# Altium project lipo_charger.PrjPcb
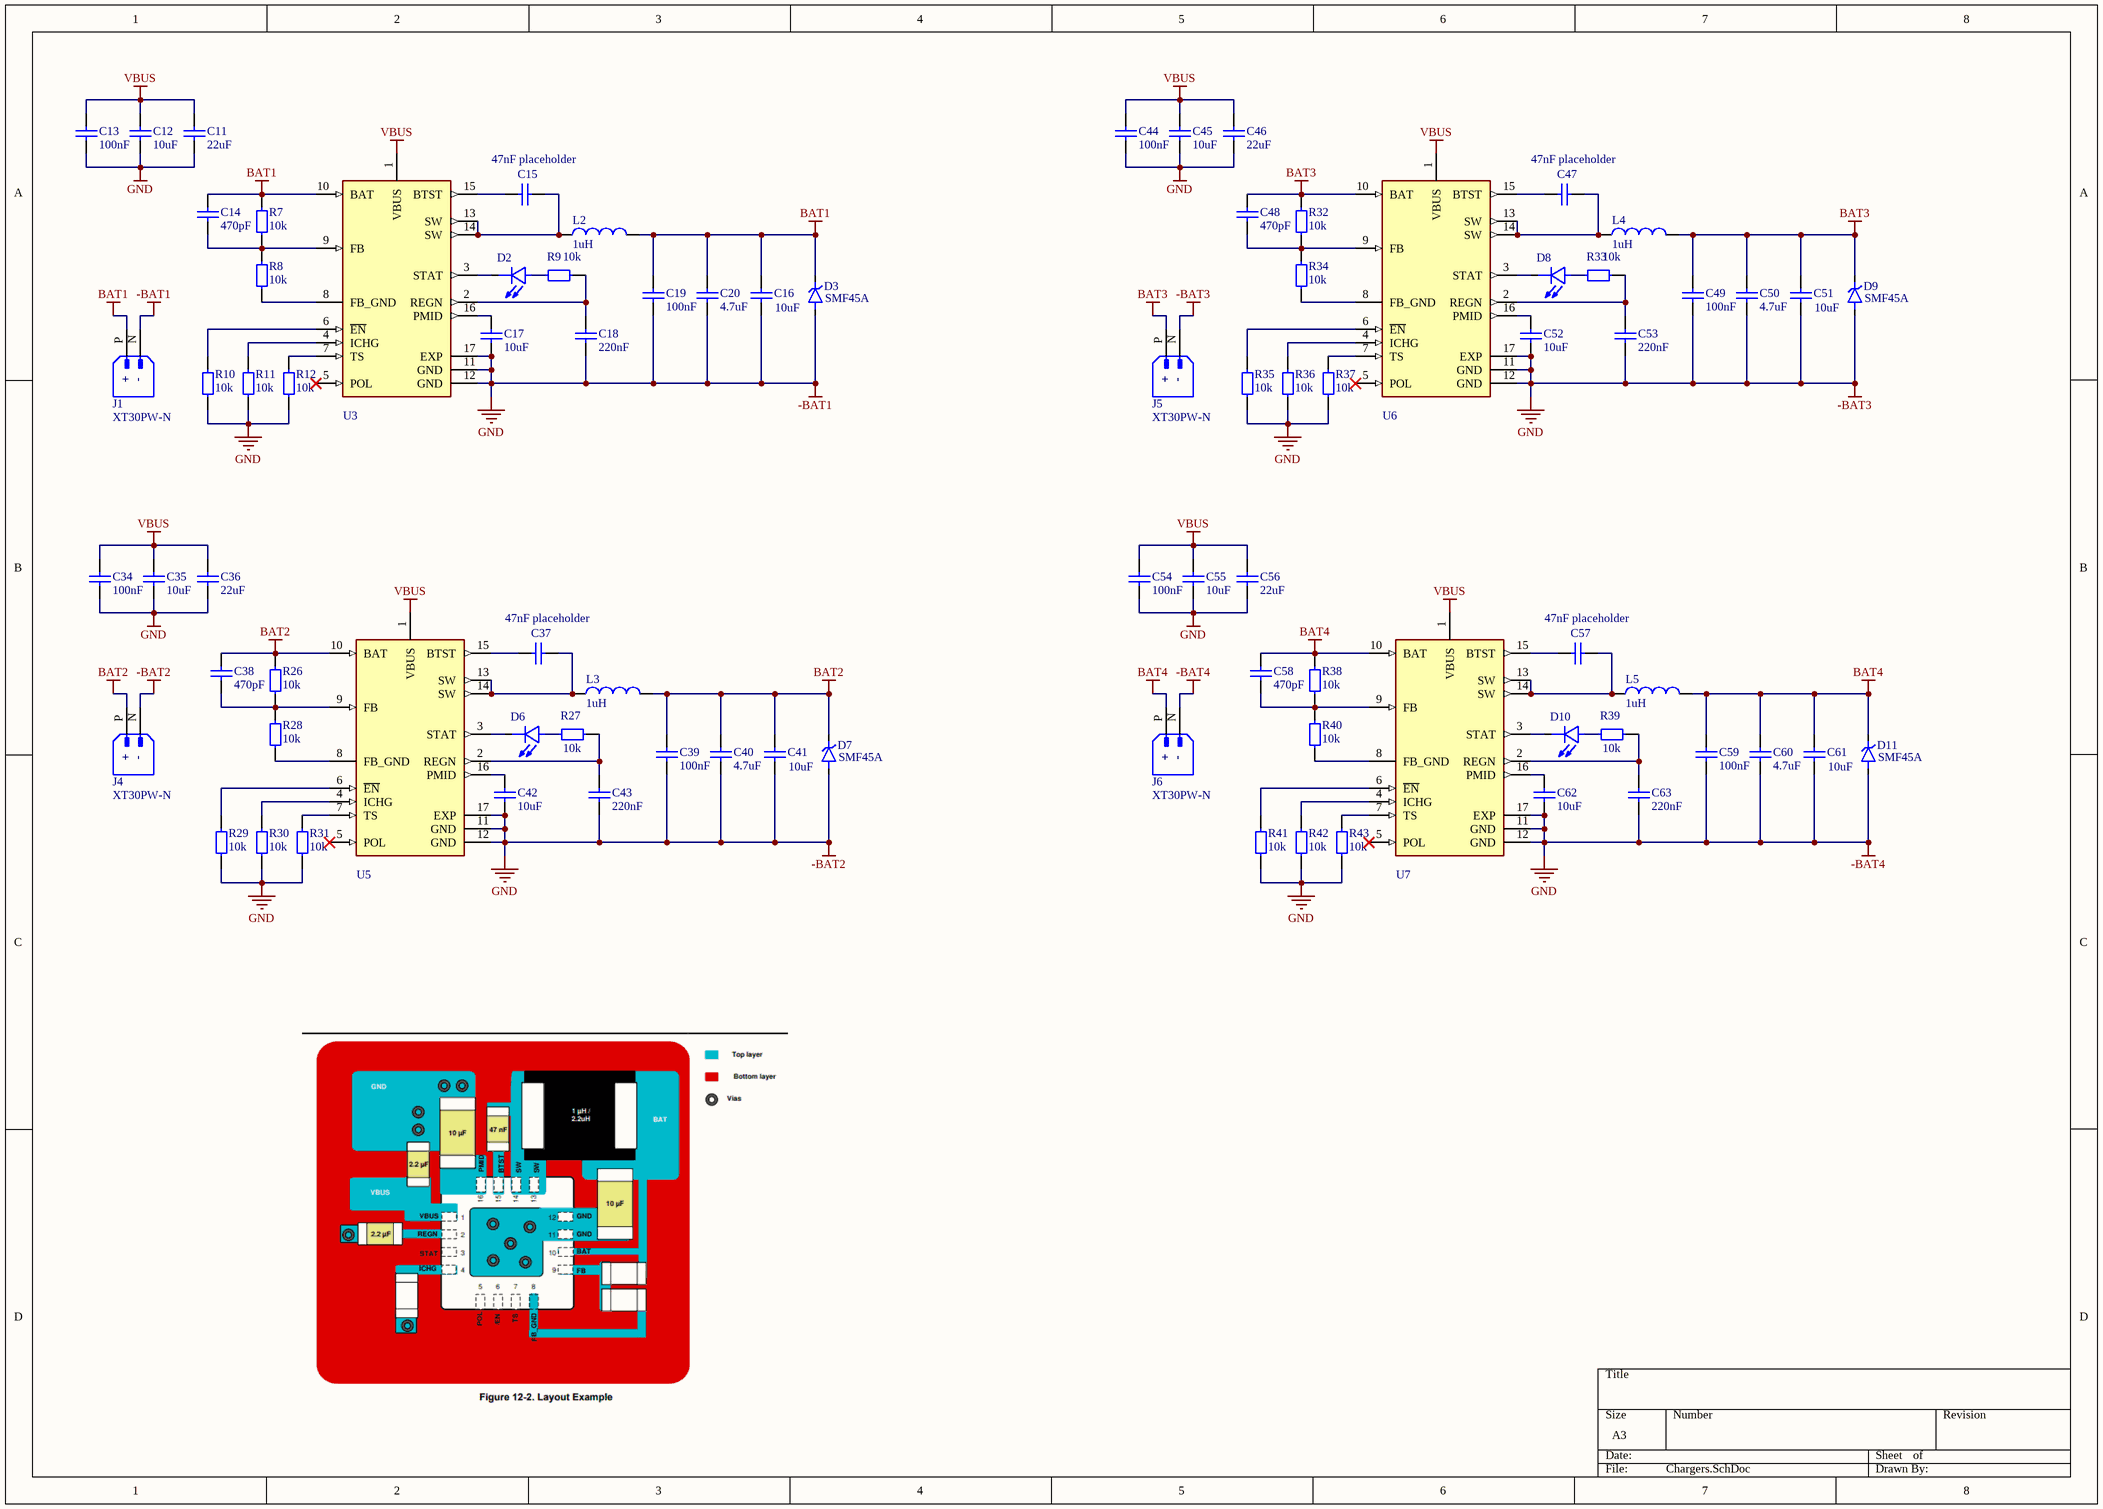
[diagram p0: Chargers.SchDoc]
6 sheets, 218 parts. Net scope: global (net labels, ports and power ports of the same name join across sheets).
Board file: PCB.PcbDoc
Sheets:
  Chargers.SchDoc
  Balancers.SchDoc
  MCU.SchDoc
  DCDC.SchDoc
  USB.SchDoc
  Dischargers.SchDoc

## Sheet Chargers.SchDoc
size A3; SheetNumber: 1; SheetTotal: 6

### Parts
C11  22uF  [1210_CAP]
C12  10uF  [0805_CAP]
C13  100nF  [0603 Capacitor]
C14  470pF  [0603 Capacitor]
C15  47nF placeholder  [0603 Capacitor]
C16  10uF  [0805_CAP]
C17  10uF  [0805_CAP]
C18  220nF  [0603 Capacitor]
C19  100nF  [0603 Capacitor]
C20  4.7uF  [0805_CAP]
C34  100nF  [0603 Capacitor]
C35  10uF  [0805_CAP]
C36  22uF  [1210_CAP]
C37  47nF placeholder  [0603 Capacitor]
C38  470pF  [0603 Capacitor]
C39  100nF  [0603 Capacitor]
C40  4.7uF  [0805_CAP]
C41  10uF  [0805_CAP]
C42  10uF  [0805_CAP]
C43  220nF  [0603 Capacitor]
C44  100nF  [0603 Capacitor]
C45  10uF  [0805_CAP]
C46  22uF  [1210_CAP]
C47  47nF placeholder  [0603 Capacitor]
C48  470pF  [0603 Capacitor]
C49  100nF  [0603 Capacitor]
C50  4.7uF  [0805_CAP]
C51  10uF  [0805_CAP]
C52  10uF  [0805_CAP]
C53  220nF  [0603 Capacitor]
C54  100nF  [0603 Capacitor]
C55  10uF  [0805_CAP]
C56  22uF  [1210_CAP]
C57  47nF placeholder  [0603 Capacitor]
C58  470pF  [0603 Capacitor]
C59  100nF  [0603 Capacitor]
C60  4.7uF  [0805_CAP]
C61  10uF  [0805_CAP]
C62  10uF  [0805_CAP]
C63  220nF  [0603 Capacitor]
D2  LTST-C190KGKT  [LED 0603]  (value not drawn)
D3  SMF45A  [SOD3718X102N]
D6  LTST-C190KGKT  [LED 0603]  (value not drawn)
D7  SMF45A  [SOD3718X102N]
D8  LTST-C190KGKT  [LED 0603]  (value not drawn)
D9  SMF45A  [SOD3718X102N]
D10  LTST-C190KGKT  [LED 0603]  (value not drawn)
D11  SMF45A  [SOD3718X102N]
J1  XT30PW-N  [AMASS_XT30UPB-M]
J4  XT30PW-N  [AMASS_XT30UPB-M]
J5  XT30PW-N  [AMASS_XT30UPB-M]
J6  XT30PW-N  [AMASS_XT30UPB-M]
L2  value 1uH  [HPPC05030]  (hidden comment: HPPC05030-1R0M-Q8)
L3  value 1uH  [HPPC05030]  (hidden comment: HPPC05030-1R0M-Q8)
L4  value 1uH  [HPPC05030]  (hidden comment: HPPC05030-1R0M-Q8)
L5  value 1uH  [HPPC05030]  (hidden comment: HPPC05030-1R0M-Q8)
R7  10k  [0603 Resistor]
R8  10k  [0603 Resistor]
R9  10k  [0603 Resistor]
R10  10k  [0603 Resistor]
R11  10k  [0603 Resistor]
R12  10k  [0603 Resistor]
R26  10k  [0603 Resistor]
R27  10k  [0603 Resistor]
R28  10k  [0603 Resistor]
R29  10k  [0603 Resistor]
R30  10k  [0603 Resistor]
R31  10k  [0603 Resistor]
R32  10k  [0603 Resistor]
R33  10k  [0603 Resistor]
R34  10k  [0603 Resistor]
R35  10k  [0603 Resistor]
R36  10k  [0603 Resistor]
R37  10k  [0603 Resistor]
R38  10k  [0603 Resistor]
R39  10k  [0603 Resistor]
R40  10k  [0603 Resistor]
R41  10k  [0603 Resistor]
R42  10k  [0603 Resistor]
R43  10k  [0603 Resistor]
U3  BQ25306RTER  [IC_BQ25306RTER]  (value not drawn)
U5  BQ25306RTER  [IC_BQ25306RTER]  (value not drawn)
U6  BQ25306RTER  [IC_BQ25306RTER]  (value not drawn)
U7  BQ25306RTER  [IC_BQ25306RTER]  (value not drawn)

### Nets
-BAT1: C11.2 C12.2 C13.2 C16.1 C17.1 C18.1 C19.1 C20.1 C34.2 C35.2 C36.2 C39.1 C40.1 C41.1 C42.1 C43.1 C44.2 C45.2 C46.2 C49.1 C50.1 C51.1 C52.1 C53.1 C54.2 C55.2 C56.2 C59.1 C60.1 C61.1 C62.1 C63.1 D3.A D7.A D9.A D11.A J1.N J4.N J5.N J6.N R10.1(CCW) R11.1(CCW) R12.1(CCW) R29.1(CCW) R30.1(CCW) R31.1(CCW) R35.1(CCW) R36.1(CCW) R37.1(CCW) R41.1(CCW) R42.1(CCW) R43.1(CCW) U3.11(GND) U3.12(GND) U3.17(EXP) U5.11(GND) U5.12(GND) U5.17(EXP) U6.11(GND) U6.12(GND) U6.17(EXP) U7.11(GND) U7.12(GND) U7.17(EXP)  [also labelled -BAT2, -BAT3, -BAT4, GND]
BAT1: C14.2 C16.2 C19.2 C20.2 D3.C(K1) J1.P(+) L2.2 R7.2(CW) U3.10(BAT)
BAT2: C38.2 C39.2 C40.2 C41.2 D7.C(K1) J4.P(+) L3.2 R26.2(CW) U5.10(BAT)
BAT3: C48.2 C49.2 C50.2 C51.2 D9.C(K1) J5.P(+) L4.2 R32.2(CW) U6.10(BAT)
BAT4: C58.2 C59.2 C60.2 C61.2 D11.C(K1) J6.P(+) L5.2 R38.2(CW) U7.10(BAT)
VBUS: C11.1 C12.1 C13.1 C34.1 C35.1 C36.1 C44.1 C45.1 C46.1 C54.1 C55.1 C56.1 U3.1(VBUS) U5.1(VBUS) U6.1(VBUS) U7.1(VBUS)
NetC14_1: C14.1 R7.1(CCW) R8.2(CW) U3.9(FB)
NetC15_1: C15.1 L2.1 U3.13(SW) U3.14(SW)
NetC15_2: C15.2 U3.15(BTST)
NetC17_2: C17.2 U3.16(PMID)
NetC18_2: C18.2 R9.1(CCW) U3.2(REGN)
NetC37_1: C37.1 L3.1 U5.13(SW) U5.14(SW)
NetC37_2: C37.2 U5.15(BTST)
NetC38_1: C38.1 R26.1(CCW) R28.2(CW) U5.9(FB)
NetC42_2: C42.2 U5.16(PMID)
NetC43_2: C43.2 R27.1(CCW) U5.2(REGN)
NetC47_1: C47.1 L4.1 U6.13(SW) U6.14(SW)
NetC47_2: C47.2 U6.15(BTST)
NetC48_1: C48.1 R32.1(CCW) R34.2(CW) U6.9(FB)
NetC52_2: C52.2 U6.16(PMID)
NetC53_2: C53.2 R33.1(CCW) U6.2(REGN)
NetC57_1: C57.1 L5.1 U7.13(SW) U7.14(SW)
NetC57_2: C57.2 U7.15(BTST)
NetC58_1: C58.1 R38.1(CCW) R40.2(CW) U7.9(FB)
NetC62_2: C62.2 U7.16(PMID)
NetC63_2: C63.2 R39.1(CCW) U7.2(REGN)
NetD2_1: D2.1(A) R9.2(CW)
NetD2_2: D2.2(C) U3.3(STAT)
NetD6_1: D6.1(A) R27.2(CW)
NetD6_2: D6.2(C) U5.3(STAT)
NetD8_1: D8.1(A) R33.2(CW)
NetD8_2: D8.2(C) U6.3(STAT)
NetD10_1: D10.1(A) R39.2(CW)
NetD10_2: D10.2(C) U7.3(STAT)
NetR8_1: R8.1(CCW) U3.8(FB_GND)
NetR10_2: R10.2(CW) U3.6(~{EN})
NetR11_2: R11.2(CW) U3.4(ICHG)
NetR12_2: R12.2(CW) U3.7(TS)
NetR28_1: R28.1(CCW) U5.8(FB_GND)
NetR29_2: R29.2(CW) U5.6(~{EN})
NetR30_2: R30.2(CW) U5.4(ICHG)
NetR31_2: R31.2(CW) U5.7(TS)
NetR34_1: R34.1(CCW) U6.8(FB_GND)
NetR35_2: R35.2(CW) U6.6(~{EN})
NetR36_2: R36.2(CW) U6.4(ICHG)
NetR37_2: R37.2(CW) U6.7(TS)
NetR40_1: R40.1(CCW) U7.8(FB_GND)
NetR41_2: R41.2(CW) U7.6(~{EN})
NetR42_2: R42.2(CW) U7.4(ICHG)
NetR43_2: R43.2(CW) U7.7(TS)

Not connected (* = marked no-connect by the designer): U3 5(POL)*; U5 5(POL)*; U6 5(POL)*; U7 5(POL)*

### Notes on the sheet
- (in symbol XT30PW-N) -

### Library data of the parts
C11 C36 C46 C56 = Capacitor 22uF 1210: 22uF 50V 1210
C12 C16 C17 C35 C41 C42 C45 C51 C52 C55 C61 C62 = Capacitor 10uF 0805: 10uF 50V 0805
C13 C19 C34 C39 C44 C49 C54 C59 = Capacitor 100nF 0603: 100nF 50V 0603
C14 C38 C48 C58 = Capacitor 470pF 0603: 470pF 50V 0603
C15 C37 C47 C57 = Capacitor 1nF 0603: 1nF 50V 0603
C18 C43 C53 C63 = Capacitor 220nF 0603: 220nF 50V 0603
C20 C40 C50 C60 = Capacitor 4.7uF 0805: 4.7uF 50V 0805
D2 D6 D8 D10 = LED 0603: 1.6x0.8mm Smd Chip Led Lamp; MF: Kingbright; MP: KPT-1608ZGC; Value: *; SnapEDA_Link: https://www.snapeda.com/parts/KPT-1608ZGC/Kingbright/view-part/?ref=snap; Availability: In Stock; Price: None; Package: 0603 Kingbright; Check_prices: https://www.snapeda.com/parts/KPT-1608ZGC/Kingbright/view-part/?ref=eda
D3 D7 D9 D11 = SMF45A: 1-channel  50V ultra-low-capacitance IEC ESD protection diode; MF: Texas Instruments; MP: TPD1E05U06DPYR; SnapEDA_Link: https://www.snapeda.com/parts/TPD1E05U06DPYR/Texas%20Instruments/view-part/383548/?ref=snap; Value: *; Texas_Instruments-Purchase-URL: https://snapeda.com/shop?store=Texas+Instruments&id=383548; Availability: Good; Price: None; Mouser-Purchase-URL: https://snapeda.com/shop?store=Mouser&id=383548; Package: X1SON-2 Texas Instruments; DigiKey-Purchase-URL: https://snapeda.com/shop?store=DigiKey&id=383548
J1 J4-J6 = XT30PW-N: Socket; DC supply; XT30; male; PIN: 2; on PCBs; THT; straight, Colour: yellow; MF: AMASS; MP: XT30PW-M; SnapEDA_Link: https://www.snapeda.com/parts/XT30PW-M/AMASS/view-part/?ref=snap; Package: None; Value: *; Check_prices: https://www.snapeda.com/parts/XT30PW-M/AMASS/view-part/?ref=eda
L2-L5 = 1uH 9A: 1uH 9A  8.9mΩ
R7-R12 R26-R43 = Resistor 10k 0603: 10k 0603
U3 U5-U7 = BQ25306RTER: TI Standalone 17-V, 3A 1-2 cell buck battery charger; MF: Texas Instruments; SnapEDA_Link: https://www.snapeda.com/parts/BQ25306RTER/Texas+Instruments/view-part/?ref=snap; Package: WFQFN-16 Texas Instruments; Value: *; MP: BQ25306RTER; Check_prices: https://www.snapeda.com/parts/BQ25306RTER/Texas+Instruments/view-part/?ref=eda

## Sheet Balancers.SchDoc
size A4; SheetNumber: 2; SheetTotal: 6
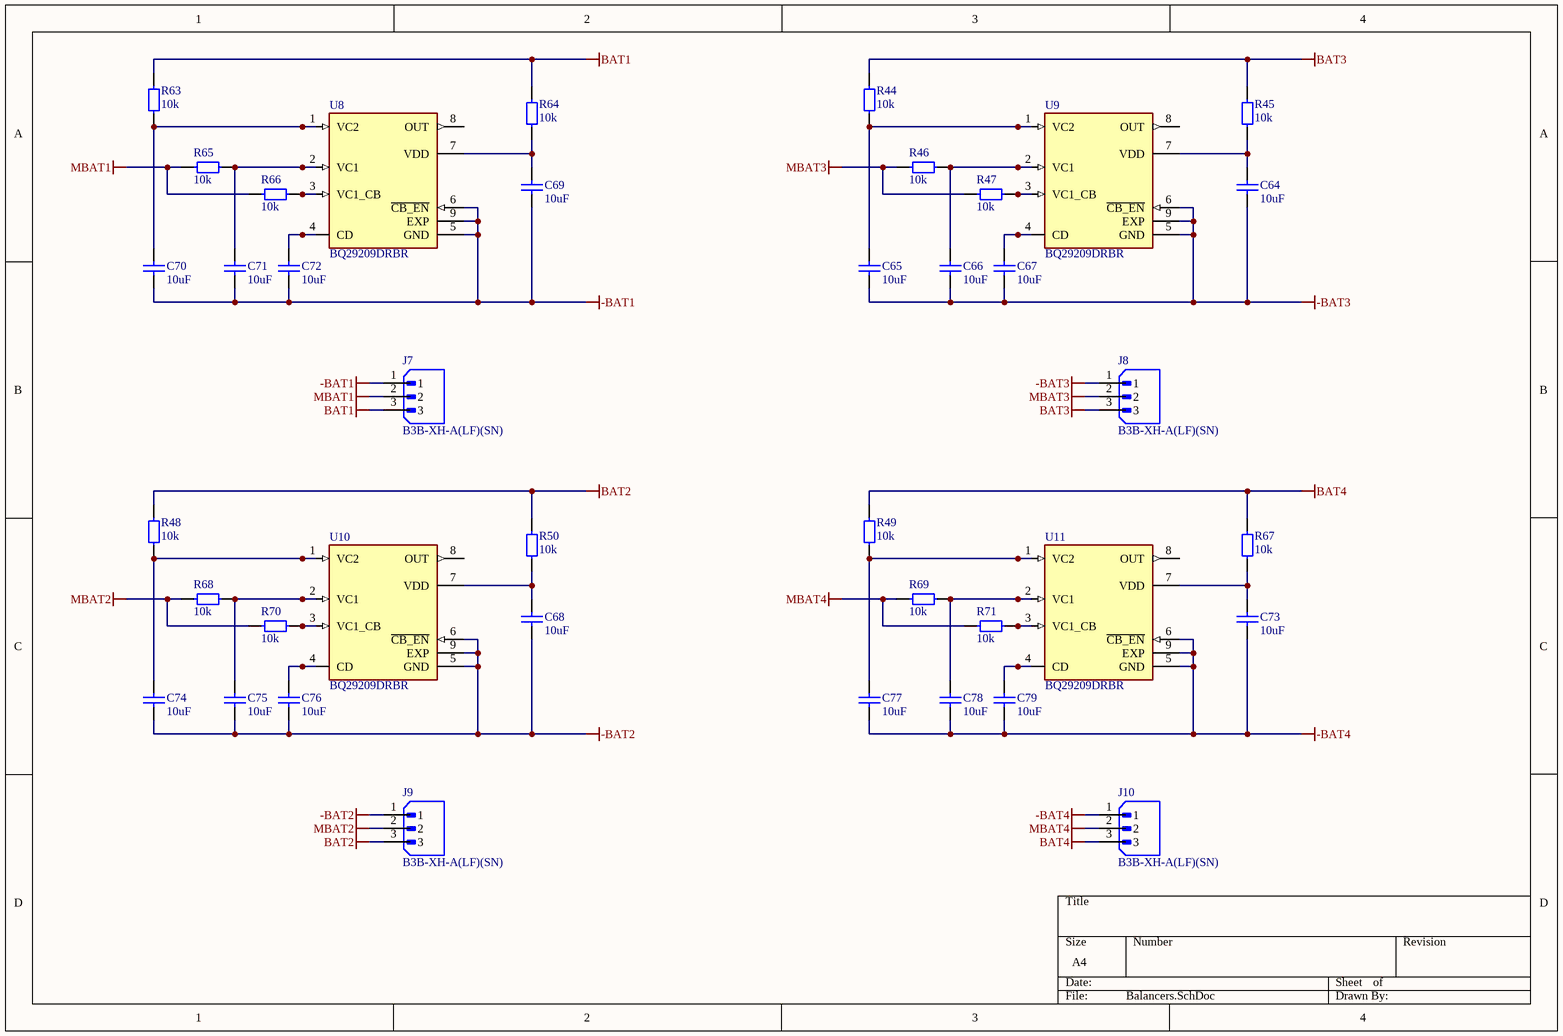
[diagram p1: Balancers.SchDoc]

### Parts
C64  10uF  [0805_CAP]
C65  10uF  [0805_CAP]
C66  10uF  [0805_CAP]
C67  10uF  [0805_CAP]
C68  10uF  [0805_CAP]
C69  10uF  [0805_CAP]
C70  10uF  [0805_CAP]
C71  10uF  [0805_CAP]
C72  10uF  [0805_CAP]
C73  10uF  [0805_CAP]
C74  10uF  [0805_CAP]
C75  10uF  [0805_CAP]
C76  10uF  [0805_CAP]
C77  10uF  [0805_CAP]
C78  10uF  [0805_CAP]
C79  10uF  [0805_CAP]
J7  B3B-XH-A(LF)(SN)  [JST_B3B-XH-A(LF)(SN)]
J8  B3B-XH-A(LF)(SN)  [JST_B3B-XH-A(LF)(SN)]
J9  B3B-XH-A(LF)(SN)  [JST_B3B-XH-A(LF)(SN)]
J10  B3B-XH-A(LF)(SN)  [JST_B3B-XH-A(LF)(SN)]
R44  10k  [0603 Resistor]
R45  10k  [0603 Resistor]
R46  10k  [0603 Resistor]
R47  10k  [0603 Resistor]
R48  10k  [0603 Resistor]
R49  10k  [0603 Resistor]
R50  10k  [0603 Resistor]
R63  10k  [0603 Resistor]
R64  10k  [0603 Resistor]
R65  10k  [0603 Resistor]
R66  10k  [0603 Resistor]
R67  10k  [0603 Resistor]
R68  10k  [0603 Resistor]
R69  10k  [0603 Resistor]
R70  10k  [0603 Resistor]
R71  10k  [0603 Resistor]
U8  BQ29209DRBR  [SON65P300X300X100-9N]
U9  BQ29209DRBR  [SON65P300X300X100-9N]
U10  BQ29209DRBR  [SON65P300X300X100-9N]
U11  BQ29209DRBR  [SON65P300X300X100-9N]

### Nets
-BAT1: C64.1 C65.1 C66.1 C67.1 C68.1 C69.1 C70.1 C71.1 C72.1 C73.1 C74.1 C75.1 C76.1 C77.1 C78.1 C79.1 J7.1 J8.1 J9.1 J10.1 U8.5(GND) U8.6(~{CB_EN}) U8.9(EXP) U9.5(GND) U9.6(~{CB_EN}) U9.9(EXP) U10.5(GND) U10.6(~{CB_EN}) U10.9(EXP) U11.5(GND) U11.6(~{CB_EN}) U11.9(EXP)  [also labelled -BAT2, -BAT3, -BAT4]
BAT1: J7.3 R63.2(CW) R64.2(CW)
BAT2: J9.3 R48.2(CW) R50.2(CW)
BAT3: J8.3 R44.2(CW) R45.2(CW)
BAT4: J10.3 R49.2(CW) R67.2(CW)
MBAT1: J7.2 R65.2(CW) R66.2(CW)
MBAT2: J9.2 R68.2(CW) R70.2(CW)
MBAT3: J8.2 R46.2(CW) R47.2(CW)
MBAT4: J10.2 R69.2(CW) R71.2(CW)
NetC64_2: C64.2 R45.1(CCW) U9.7(VDD)
NetC65_2: C65.2 R44.1(CCW) U9.1(VC2)
NetC66_2: C66.2 R46.1(CCW) U9.2(VC1)
NetC67_2: C67.2 U9.4(CD)
NetC68_2: C68.2 R50.1(CCW) U10.7(VDD)
NetC69_2: C69.2 R64.1(CCW) U8.7(VDD)
NetC70_2: C70.2 R63.1(CCW) U8.1(VC2)
NetC71_2: C71.2 R65.1(CCW) U8.2(VC1)
NetC72_2: C72.2 U8.4(CD)
NetC73_2: C73.2 R67.1(CCW) U11.7(VDD)
NetC74_2: C74.2 R48.1(CCW) U10.1(VC2)
NetC75_2: C75.2 R68.1(CCW) U10.2(VC1)
NetC76_2: C76.2 U10.4(CD)
NetC77_2: C77.2 R49.1(CCW) U11.1(VC2)
NetC78_2: C78.2 R69.1(CCW) U11.2(VC1)
NetC79_2: C79.2 U11.4(CD)
NetR47_1: R47.1(CCW) U9.3(VC1_CB)
NetR66_1: R66.1(CCW) U8.3(VC1_CB)
NetR70_1: R70.1(CCW) U10.3(VC1_CB)
NetR71_1: R71.1(CCW) U11.3(VC1_CB)

Not connected (* = marked no-connect by the designer): U8 8(OUT); U9 8(OUT); U10 8(OUT); U11 8(OUT)

### Library data of the parts
C64-C79 = Capacitor 10uF 0805: 10uF 50V 0805
J7-J10 = B3B-XH-A(LF)(SN): Connector Header Through Hole 3 position 0.098 (2.50mm); MF: JST Sales; SnapEDA_Link: https://www.snapeda.com/parts/B3B-XH-A(LF)(SN)/JST/view-part/?ref=snap; Package: None; Value: *; MP: B3B-XH-A(LF)(SN); Check_prices: https://www.snapeda.com/parts/B3B-XH-A(LF)(SN)/JST/view-part/?ref=eda
R44-R50 R63-R71 = Resistor 10k 0603: 10k 0603
U8-U11 = BQ29209DRBR: Voltage Protection with Automatic Cell Balance For 2-Cell Li-Ion Batteries, OVP=4.30V; MF: Texas Instruments; SnapEDA_Link: https://www.snapeda.com/parts/BQ29209DRBR/Texas+Instruments/view-part/?ref=snap; Package: VSON-8 Texas Instruments; Value: *; MP: BQ29209DRBR; Check_prices: https://www.snapeda.com/parts/BQ29209DRBR/Texas+Instruments/view-part/?ref=eda

## Sheet MCU.SchDoc
size A4; SheetNumber: 3; SheetTotal: 6
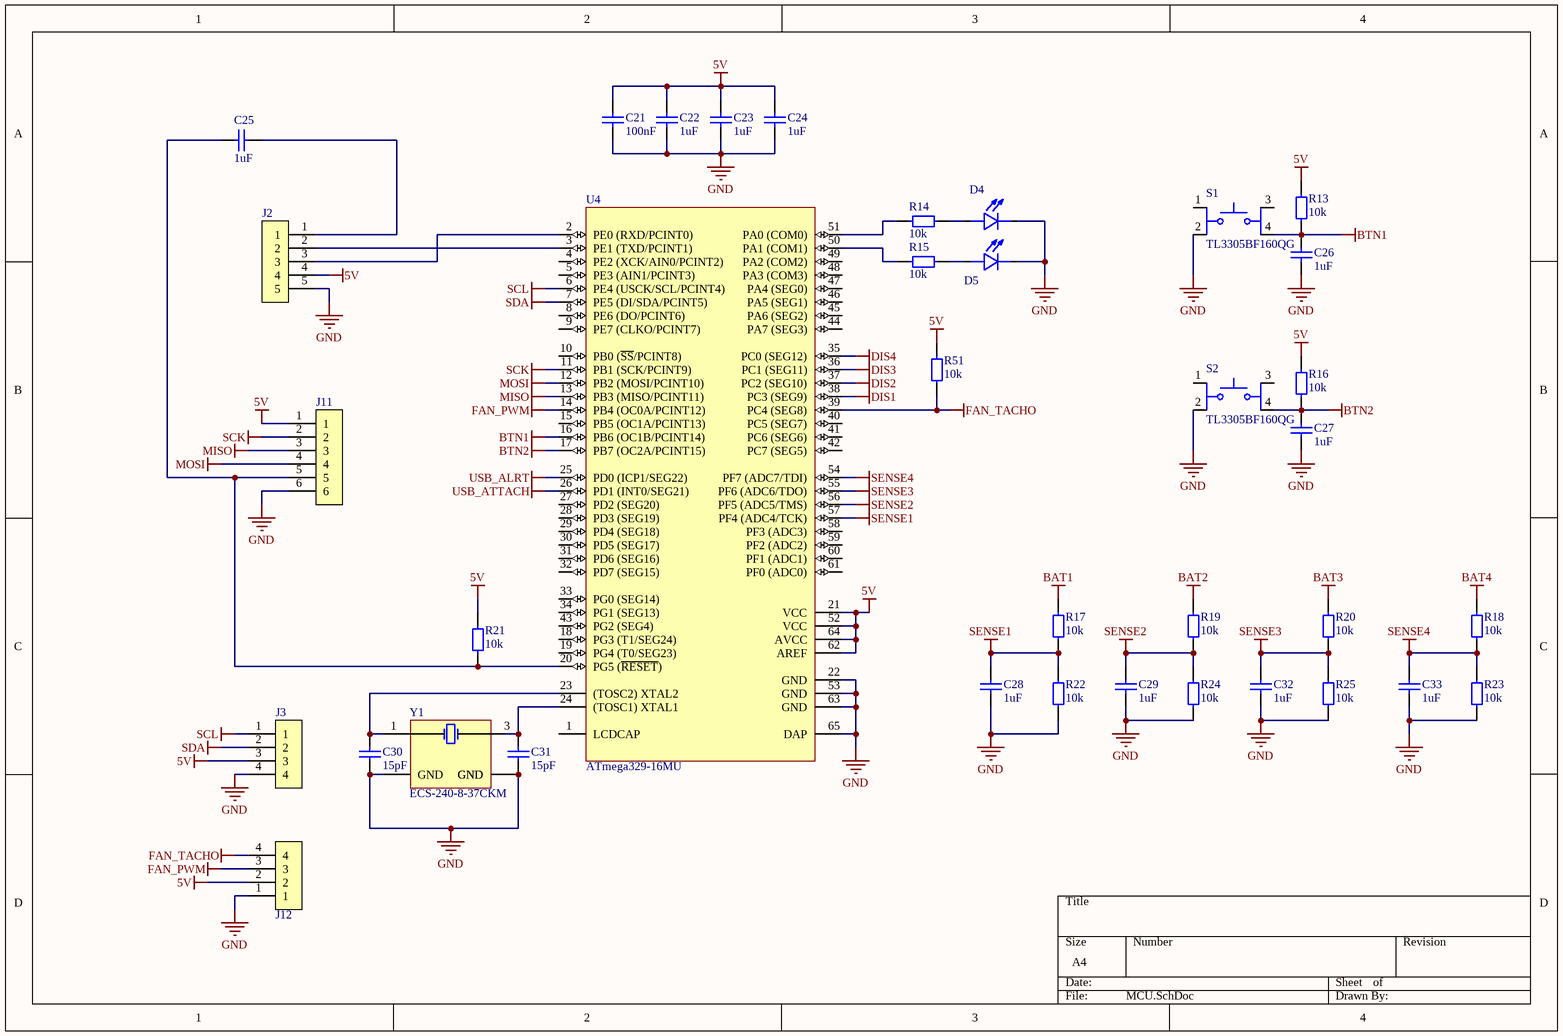
[diagram p2: MCU.SchDoc]

### Parts
C21  100nF  [0603 Capacitor]
C22  1uF  [0603 Capacitor]
C23  1uF  [0603 Capacitor]
C24  1uF  [0603 Capacitor]
C25  1uF  [0603 Capacitor]
C26  1uF  [0603 Capacitor]
C27  1uF  [0603 Capacitor]
C28  1uF  [0603 Capacitor]
C29  1uF  [0603 Capacitor]
C30  15pF  [0603 Capacitor]
C31  15pF  [0603 Capacitor]
C32  1uF  [0603 Capacitor]
C33  1uF  [0603 Capacitor]
D4  LTST-C190KGKT  [LED 0603]  (value not drawn)
D5  LTST-C190KGKT  [LED 0603]  (value not drawn)
J2  5-534237-3  [5pin header]  (value not drawn)
J3  MTSW-104-07-G-S-000  [HDRV4W64P0X254_1X4_1016X254X864P]  (value not drawn)
J11  MTSW-106-07-L-S-210  [SAMTEC_MTSW-106-23-L-S-240]  (value not drawn)
J12  MTSW-104-07-G-S-000  [HDRV4W64P0X254_1X4_1016X254X864P]  (value not drawn)
R13  10k  [0603 Resistor]
R14  10k  [0603 Resistor]
R15  10k  [0603 Resistor]
R16  10k  [0603 Resistor]
R17  10k  [0603 Resistor]
R18  10k  [0603 Resistor]
R19  10k  [0603 Resistor]
R20  10k  [0603 Resistor]
R21  10k  [0603 Resistor]
R22  10k  [0603 Resistor]
R23  10k  [0603 Resistor]
R24  10k  [0603 Resistor]
R25  10k  [0603 Resistor]
R51  10k  [0603 Resistor]
S1  TL3305BF160QG  [SW_TL3305BF160QG]
S2  TL3305BF160QG  [SW_TL3305BF160QG]
U4  ATmega329-16MU  [ATmega329]
Y1  ECS-240-8-37CKM  [XTAL_ECS-240-8-37CKM]

### Nets
5V: C21.2 C22.2 C23.2 C24.2 J2.4 J3.3 J11.1 J12.2 R13.1(CCW) R16.1(CCW) R21.1(CCW) R51.2(CW) U4.21(VCC) U4.52(VCC) U4.62(AREF) U4.64(AVCC)
BAT1: R17.1(CCW)
BAT2: R19.1(CCW)
BAT3: R20.1(CCW)
BAT4: R18.1(CCW)
BTN1: C26.2 R13.2(CW) S1.4 U4.16(PB6_(OC1B/PCINT14))
BTN2: C27.2 R16.2(CW) S2.4 U4.17(PB7_(OC2A/PCINT15))
DIS1: U4.38(PC3_(SEG9))
DIS2: U4.37(PC2_(SEG10))
DIS3: U4.36(PC1_(SEG11))
DIS4: U4.35(PC0_(SEG12))
FAN_PWM: J12.3 U4.14(PB4_(OC0A/PCINT12))
FAN_TACHO: J12.4 R51.1(CCW) U4.39(PC4_(SEG8))
GND: C21.1 C22.1 C23.1 C24.1 C26.1 C27.1 C28.1 C29.1 C30.1 C31.1 C32.1 C33.1 D4.2(C) D5.2(C) J2.5 J3.4 J11.6 J12.1 R22.2(CW) R23.2(CW) R24.2(CW) R25.2(CW) S1.2 S2.2 U4.22(GND) U4.53(GND) U4.63(GND) U4.65(DAP) Y1.2(GND) Y1.4(GND)  [project net -BAT1]
MISO: J11.3 U4.13(PB3_(MISO/PCINT11))
MOSI: J11.4 U4.12(PB2_(MOSI/PCINT10))
SCK: J11.2 U4.11(PB1_(SCK/PCINT9))
SCL: J3.1 U4.6(PE4_(USCK/SCL/PCINT4))
SDA: J3.2 U4.7(PE5_(DI/SDA/PCINT5))
SENSE1: C28.2 R17.2(CW) R22.1(CCW) U4.57(PF4_(ADC4/TCK))
SENSE2: C29.2 R19.2(CW) R24.1(CCW) U4.56(PF5_(ADC5/TMS))
SENSE3: C32.2 R20.2(CW) R25.1(CCW) U4.55(PF6_(ADC6/TDO))
SENSE4: C33.2 R18.2(CW) R23.1(CCW) U4.54(PF7_(ADC7/TDI))
USB_ALRT: U4.25(PD0_(ICP1/SEG22))
USB_ATTACH: U4.26(PD1_(INT0/SEG21))
NetC25_1: C25.1 J2.1
NetC25_2: C25.2 J11.5 R21.2(CW) U4.20(PG5_(~{RESET}))
NetC30_2: C30.2 U4.23((TOSC2)_XTAL2) Y1.1(X1)
NetC31_2: C31.2 U4.24((TOSC1)_XTAL1) Y1.3(X2)
NetD4_1: D4.1(A) R14.1(CCW)
NetD5_1: D5.1(A) R15.1(CCW)
NetJ2_2: J2.2 U4.3(PE1_(TXD/PCINT1))
NetJ2_3: J2.3 U4.2(PE0_(RXD/PCINT0))
NetR14_2: R14.2(CW) U4.51(PA0_(COM0))
NetR15_2: R15.2(CW) U4.50(PA1_(COM1))

Not connected (* = marked no-connect by the designer): S1 1 3; S2 1 3; U4 1(LCDCAP) 4(PE2_(XCK/AIN0/PCINT2)) 5(PE3_(AIN1/PCINT3)) 8(PE6_(DO/PCINT6)) 9(PE7_(CLKO/PCINT7)) 10(PB0_(~{SS}/PCINT8)) 15(PB5_(OC1A/PCINT13)) 18(PG3_(T1/SEG24)) 19(PG4_(T0/SEG23)) 27(PD2_(SEG20)) 28(PD3_(SEG19)) 29(PD4_(SEG18)) 30(PD5_(SEG17)) 31(PD6_(SEG16)) 32(PD7_(SEG15)) 33(PG0_(SEG14)) 34(PG1_(SEG13)) 40(PC5_(SEG7)) 41(PC6_(SEG6)) 42(PC7_(SEG5)) 43(PG2_(SEG4)) 44(PA7_(SEG3)) 45(PA6_(SEG2)) 46(PA5_(SEG1)) 47(PA4_(SEG0)) 48(PA3_(COM3)) 49(PA2_(COM2)) 58(PF3_(ADC3)) 59(PF2_(ADC2)) 60(PF1_(ADC1)) 61(PF0_(ADC0))

### Library data of the parts
C21 = Capacitor 100nF 0603: 100nF 50V 0603
C22-C29 C32 C33 = Capacitor 1uF 0603: 1uF 50V 0603
C30 C31 = Capacitor 15pF 0603: 15pF 50V 0603; MP: KAM15AR71H103MT
D4 D5 = LED 0603: as D2 on sheet Chargers; Value: *; SnapEDA_Link: https://www.snapeda.com/parts/KPT-1608ZGC/Kingbright/view-part/?ref=snap; Availability: In Stock; Price: None; Package: 0603 Kingbright; Check_prices: https://www.snapeda.com/parts/KPT-1608ZGC/Kingbright/view-part/?ref=eda
J2 = 5pin 2.54 SAMTEC: 2.54mm; MF: {'manufacturer': 'TE Connectivity'}; MP: 534237-4; Availability: Unavailable; Package: None; Value: *; Price: None
J3 J12 = 4 pin header: CONN HEADER VERT 4POS 2.54MM; Manufacturer_Name: SAMTEC; Geometry.Height: 8.64mm; Manufacturer_Part_Number: MTSW-104-07-G-S-000; Mouser Part Number: *; Mouser Price/Stock: *; Arrow Part Number: *; Arrow Price/Stock: *; Datasheet Link: http://suddendocs.samtec.com/catalog_english/mtsw.pdf
  J12: MP: 4 pin header
J11 = 6 pin header: CONN HEADER VERT 6POS 2.54MM; Manufacturer_Name: SAMTEC; Manufacturer_Part_Number: MTSW-104-07-G-S-000; Geometry.Height: 8.64mm; MP: 4 pin header; Mouser Part Number: *; Mouser Price/Stock: *; Arrow Part Number: *; Arrow Price/Stock: *; Datasheet Link: http://suddendocs.samtec.com/catalog_english/mtsw.pdf
R13-R25 R51 = Resistor 10k 0603: 10k 0603
S1 S2 = TL3305BF160QG: Tactile Switch SPST-NO Top Actuated Surface Mount; MF: E-Switch; SnapEDA_Link: https://www.snapeda.com/parts/TL3305BF160QG/E-Switch/view-part/?ref=snap; Package: None; MP: TL3305BF160QG; Check_prices: https://www.snapeda.com/parts/TL3305BF160QG/E-Switch/view-part/?ref=eda; Purchase-URL: https://pricing.snapeda.com/search/part/TL3305BF160QG/?ref=eda; Price: None; Value: *; Availability: In Stock
U4 = ATmega329-16MU: 8-bit AVR Microcontroller, 2.7-5.5V, 32KB Flash, 1KB EEPROM, 2KB SRAM, 64-pin MLF, Industrial Grade (-40°C to 85°C); ComponentLink3Description: ATmega329/3290/649/6490 Summary; PackageDescription: 64-Pin Micro Lead Frame Package (MLF), 9 x 9 x 1.0 mm Body, 0.5 mm Pitch, 5.40 mm Exposed Pad; RevisionNote: DatasheetVersion & PackageVersion updated. URLs added.; ComponentLink1URL: http://www.atmel.com/; ComponentLink2URL: http://www.atmel.com/dyn/resources/prod_documents/doc2552.pdf; DatasheetVersion: revK, Apr-2011; ComponentLink2Description: ATmega329/3290/649/6490 Datasheet; Code_JEDEC: MO-220-VMMD; ComponentLink1Description: Manufacturer URL; PackageReference: 64M1; PackageVersion: revH, Oct-2010; ComponentLink3URL: http://www.atmel.com/dyn/resources/prod_documents/2552S.pdf
Y1 = ECS-240-8-37CKM: Output Current: 3 mA; Case\Package: SOT-553-6; Min Supply Voltage (DC): 4 V; Max Supply Voltage: 3.3 V; Min Supply Voltage: 1.4 V; Interface: I2C; Max Supply Voltage (DC): 6 V; ComponentLink2Description: Datasheet; REACH SVHC: No SVHC; ComponentLink1URL: http://www.foxonline.com/; ComponentLink2URL: http://foxonline.com/pdfs/hc49sdlf.pdf; Pins: 6; Packaging: Cut Tape; ComponentLink1Description: Manufacturer URL; Weight: 9.9E-05 oz; Length: 1.6 mm; RoHSCompliant: true; Min Operating Temperature: -55 degC; Radiation Hardening: No; PackageDescription: 2-Pin Surface Mount Device, Body 5 x 11.7 mm, Height 4.5 mm; Package Quantity: 1; Width: 1.2 mm; DatasheetVersion: Mar-15; Max Operating Temperature: 150 degC; Mount: Surface Mount; PackageReference: FOX-FOXSDLF160-20; Height: 0.55 mm

## Sheet DCDC.SchDoc
size A4; SheetNumber: 4; SheetTotal: 6
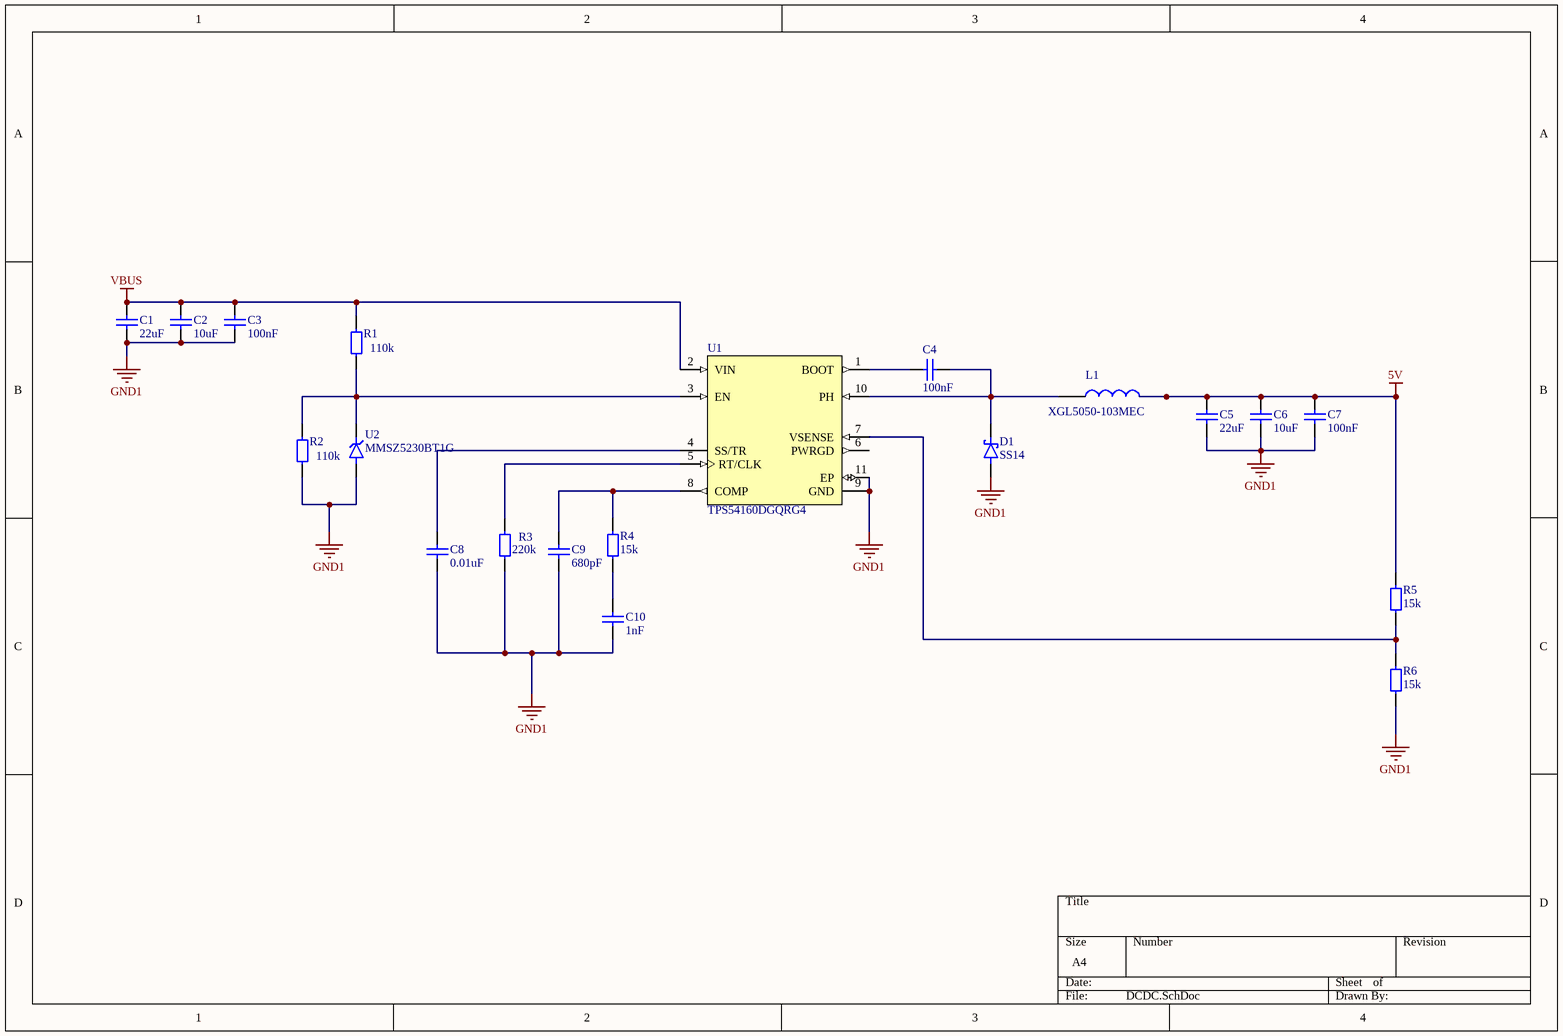
[diagram p3: DCDC.SchDoc]

### Parts
C1  22uF  [1210_CAP]
C2  10uF  [0805_CAP]
C3  100nF  [0603 Capacitor]
C4  100nF  [0603 Capacitor]
C5  22uF  [1210_CAP]
C6  10uF  [0805_CAP]
C7  100nF  [0603 Capacitor]
C8  0.01uF  [0603 Capacitor]
C9  680pF  [0603 Capacitor]
C10  1nF  [0603 Capacitor]
D1  SS14  [DIOM4330X250N]
L1  XGL5050-103MEC  [XGL5050]
R1  110k  [0603 Resistor]
R2  110k  [0603 Resistor]
R3  220k  [0603 Resistor]
R4  15k  [0603 Resistor]
R5  15k  [0603 Resistor]
R6  15k  [0603 Resistor]
U1  TPS54160DGQRG4  [IC_XTR111AIDGQR]
U2  MMSZ5230BT1G  [DIO_SZMMSZ5248CT1G]

### Nets
5V: C5.2 C6.2 C7.2 L1.2 R5.2(CW)
GND1: C1.1 C2.1 C3.1 C5.1 C6.1 C7.1 C8.1 C9.1 C10.1 D1.A R2.1(CCW) R3.1(CCW) R6.1(CCW) U1.9(GND) U1.11(EP) U2.2(A)
VBUS: C1.2 C2.2 C3.2 R1.2(CW) U1.2(VIN)
NetC4_1: C4.1 U1.1(BOOT)
NetC4_2: C4.2 D1.C(K) L1.1 U1.10(PH)
NetC8_2: C8.2 U1.4(SS/TR)
NetC9_2: C9.2 R4.2(CW) U1.8(COMP)
NetC10_2: C10.2 R4.1(CCW)
NetR1_1: R1.1(CCW) R2.2(CW) U1.3(EN) U2.1(K)
NetR3_2: R3.2(CW) U1.5(RT/CLK)
NetR5_1: R5.1(CCW) R6.2(CW) U1.7(VSENSE)

Not connected (* = marked no-connect by the designer): U1 6(PWRGD)

### Library data of the parts
C1 C5 = Capacitor 22uF 1210: 22uF 50V 1210
C2 C6 = Capacitor 10uF 0805: 10uF 50V 0805
C3 C4 C7-C10 = Capacitor 100nF 0603: 100nF 50V 0603
D1 = SS14: 1A, 40V, Schottky Rectifier; Value: *; Availability: Unavailable; Price: None; Package: None; MP: SS14
L1 = XGL5050-103MEC: 10uH Shielded Molded Inductor 2.5 A; Manufacturer_Name: COILCRAFT; Manufacturer_Part_Number: XGL5050-153MEC; Geometry.Height: 5.1mm; Mouser Part Number: *; Mouser Price/Stock: *; Arrow Part Number: *; Arrow Price/Stock: *; Datasheet Link: https://www.coilcraft.com/getmedia/348b2df6-54b3-4579-8737-e8367b6fa367/xgl5050.pdf
R1-R6 = Resistor 100k 0603: 100k 0603
U1 = TPS54160DGQRG4: 3.5V to 60V Input, 1.5A Step-Down Converter with Eco-Mode 10-HVSSOP -40 to 150; MF: Texas Instruments; SnapEDA_Link: https://www.snapeda.com/parts/TPS54160DGQRG4/Texas+Instruments/view-part/?ref=snap; Package: HVSSOP-10 Texas Instruments; Value: *; MP: TPS54160DGQRG4; Check_prices: https://www.snapeda.com/parts/TPS54160DGQRG4/Texas+Instruments/view-part/?ref=eda
U2 = MMSZ5230BT1G: Zener Diode 4.7V 500 mW ±2% Surface Mount SOD-123; MP: SZMMSZ5248CT1G; MF: ON Semiconductor; Package: SOD-123-2 ON Semiconductor; Value: *; SnapEDA_Link: https://www.snapeda.com/parts/SZMMSZ5248CT1G/Onsemi/view-part/?ref=snap; Check_prices: https://www.snapeda.com/parts/SZMMSZ5248CT1G/Onsemi/view-part/?ref=eda

## Sheet USB.SchDoc
size A4; SheetNumber: 5; SheetTotal: 6
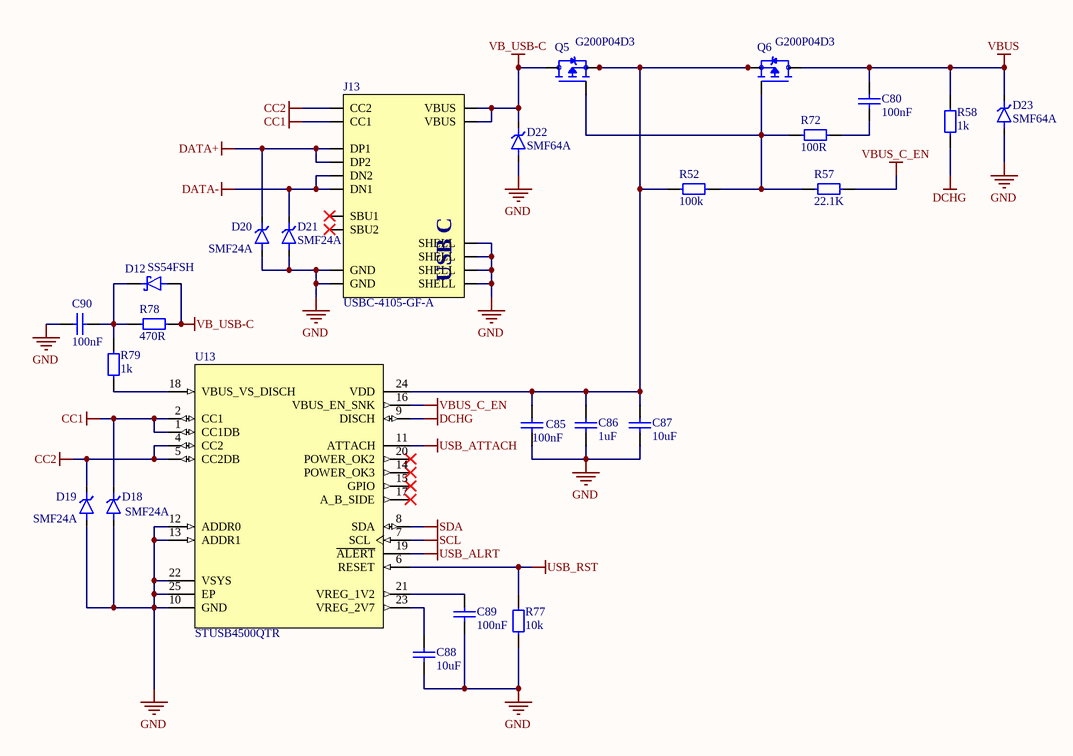
[diagram p4: USB.SchDoc]

### Parts
C80  100nF  [0603 Capacitor]
C85  100nF  [0603 Capacitor]
C86  1uF  [0603 Capacitor]
C87  10uF  [0603 Capacitor]
C88  10uF  [0603 Capacitor]
C89  100nF  [0603 Capacitor]
C90  100nF  [0603 Capacitor]
D12  SS54FSH  [SODFL4725X110N]
D18  SMF24A  [SOD3718X102N]
D19  SMF24A  [SOD3718X102N]
D20  SMF24A  [SOD3718X102N]
D21  SMF24A  [SOD3718X102N]
D22  SMF64A  [SOD3718X102N]
D23  SMF64A  [SOD3718X102N]
J13  USBC-4105-GF-A  [GCT_USB4105-GF-A]
Q5  G200P04D3  [TRANS_AONR21321]
Q6  G200P04D3  [TRANS_AONR21321]
R52  100k  [0603 Resistor]
R57  22.1K  [0603 Resistor]
R58  1k  [0603 Resistor]
R72  100R  [0603 Resistor]
R77  10k  [0603 Resistor]
R78  470R  [0603 Resistor]
R79  1k  [0603 Resistor]
U13  STUSB4500QTR  [QFN50P400X400X90-25N]

### Nets
CC1: D18.C(K1) J13.A5(CC1) U13.1(CC1DB) U13.2(CC1)
CC2: D19.C(K1) J13.B5(CC2) U13.4(CC2) U13.5(CC2DB)
DATA+: D20.C(K1) J13.A6(DP1) J13.B6(DP2)
DATA-: D21.C(K1) J13.A7(DN1) J13.B7(DN2)
DCHG: R58.1(CCW) U13.9(DISCH)
GND: C85.1 C86.1 C87.1 C88.1 C89.1 C90.1 D18.A D19.A D20.A D21.A D22.A D23.A J13.A1_B12(GND) J13.B1_A12(GND) J13.SH1(SHELL) J13.SH2(SHELL) J13.SH3(SHELL) J13.SH4(SHELL) R77.1(CCW) U13.10(GND) U13.12(ADDR0) U13.13(ADDR1) U13.22(VSYS) U13.25(EP)  [project net -BAT1]
SCL: U13.7(SCL)
SDA: U13.8(SDA)
USB_ALRT: U13.19(~{ALERT})
USB_ATTACH: U13.11(ATTACH)
USB_RST: R77.2(CW) U13.6(RESET)
VB_USB-C: D12.A D22.C(K1) J13.A4_B9(VBUS) J13.B4_A9(VBUS) Q5.5(D) R78.2(CW)
VBUS: C80.2 D23.C(K1) Q6.5(D) R58.2(CW)
VBUS_C_EN: R57.2(CW) U13.16(VBUS_EN_SNK)
NetC80_1: C80.1 R72.2(CW)
NetC85_2: C85.2 C86.2 C87.2 Q5.1(S) Q5.2(S) Q5.3(S) Q6.1(S) Q6.2(S) Q6.3(S) R52.1(CCW) U13.24(VDD)
NetC88_2: C88.2 U13.23(VREG_2V7)
NetC89_2: C89.2 U13.21(VREG_1V2)
NetC90_2: C90.2 D12.C(K) R78.1(CCW) R79.1(CCW)
NetQ5_4: Q5.4(G) Q6.4(G) R52.2(CW) R57.1(CCW) R72.1(CCW)
NetR79_2: R79.2(CW) U13.18(VBUS_VS_DISCH)

Not connected (* = marked no-connect by the designer): J13 A8(SBU1)* B8(SBU2)*; U13 14(POWER_OK3)* 15(GPIO)* 17(A_B_SIDE)* 20(POWER_OK2)*

### Notes on the sheet
- (in symbol USBC-4105-GF-A) USB C

### Library data of the parts
C80 C85 C89 C90 = Capacitor 100nF 0603: 100nF 50V 0603; MP: KGF15AR71H104KM
C86 = Capacitor 1uF 0603: 1uF 50V 0603
C87 C88 = Capacitor 10uF 0603: 10uF 10V 0603
D12 = SS54FSH: 5A, 40V, Schottky Rectifier; MF: Taiwan Semiconductor; Value: *; SnapEDA_Link: https://www.snapeda.com/parts/SS54FSH/Taiwan+Semiconductor/view-part/?ref=snap; MP: SS54FSH; Check_prices: https://www.snapeda.com/parts/SS54FSH/Taiwan+Semiconductor/view-part/?ref=eda; Availability: In Stock; Price: None; Package: SOD-128-2 Taiwan Semiconductor
D18-D21 = SMF24A: 1-channel  24V ultra-low-capacitance IEC ESD protection diode; MF: Texas Instruments; MP: TPD1E05U06DPYR; SnapEDA_Link: https://www.snapeda.com/parts/TPD1E05U06DPYR/Texas%20Instruments/view-part/383548/?ref=snap; Value: *; Texas_Instruments-Purchase-URL: https://snapeda.com/shop?store=Texas+Instruments&id=383548; Availability: Good; Price: None; Mouser-Purchase-URL: https://snapeda.com/shop?store=Mouser&id=383548; Package: X1SON-2 Texas Instruments; DigiKey-Purchase-URL: https://snapeda.com/shop?store=DigiKey&id=383548
D22 D23 = SMF64A: 1-channel  64V ultra-low-capacitance IEC ESD protection diode; MF: Texas Instruments; MP: TPD1E05U06DPYR; SnapEDA_Link: https://www.snapeda.com/parts/TPD1E05U06DPYR/Texas%20Instruments/view-part/383548/?ref=snap; Value: *; Texas_Instruments-Purchase-URL: https://snapeda.com/shop?store=Texas+Instruments&id=383548; Availability: Good; Price: None; Mouser-Purchase-URL: https://snapeda.com/shop?store=Mouser&id=383548; Package: X1SON-2 Texas Instruments; DigiKey-Purchase-URL: https://snapeda.com/shop?store=DigiKey&id=383548
J13 = USBC-4105-GF-A: MF: {'manufacturer': u'GCT'}; Package: None; Price: None; Value: *; MP: USBC-4105-GF-A; Availability: Unavailable
Q5 Q6 = G200P04D3: P-Channel 40 V 20A Surface; MF: onsemi; MP: BSS138; SnapEDA_Link: https://www.snapeda.com/parts/BSS138/Onsemi/view-part/?ref=snap; Package: SOT-23-3 Motorola; Value: *; Check_prices: https://www.snapeda.com/parts/BSS138/Onsemi/view-part/?ref=eda
R52 = Resistor 100k 0603: 100k 0603; MP: RCG0603100KFKEA
R57 = Resistor 22.1K 0603: 22.1K 0603
R58 R79 = Resistor 1k 0603: 1k 0603
R72 = Resistor 100R 0603: 100R 0603; Manufacturer_Part_Number: RE0603FRE07100RL; MP: RE0603FRE07100RL
R77 = Resistor 10k 0603: 10k 0603; MP: RE0603FRE1310KL
R78 = Resistor 470R 0603: 470R 0603
U13 = STUSB4500QTR: USB Controller USB 2.0 I2C Interface 24-QFN (4x4); MF: STMicroelectronics; SnapEDA_Link: https://www.snapeda.com/parts/STUSB4500QTR/STMicroelectronics/view-part/?ref=snap; Package: VFQFN-24 STMicroelectronics; Value: *; MP: STUSB4500QTR; Check_prices: https://www.snapeda.com/parts/STUSB4500QTR/STMicroelectronics/view-part/?ref=eda

## Sheet Dischargers.SchDoc
size A4; SheetNumber: 6; SheetTotal: 6
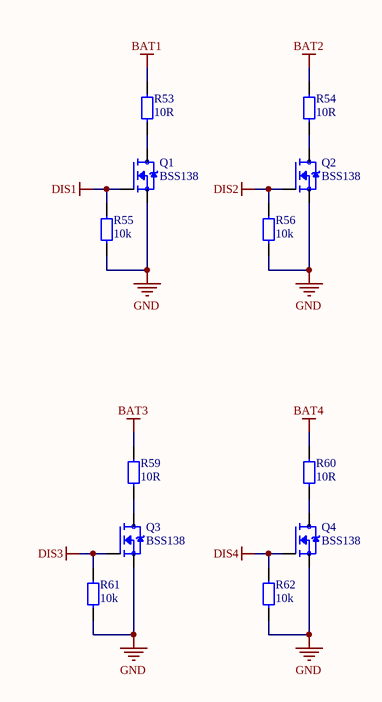
[diagram p5: Dischargers.SchDoc]

### Parts
Q1  BSS138  [TRANS_SS8050-G]
Q2  BSS138  [TRANS_SS8050-G]
Q3  BSS138  [TRANS_SS8050-G]
Q4  BSS138  [TRANS_SS8050-G]
R53  10R  [THT 3W resistor]
R54  10R  [THT 3W resistor]
R55  value 10k  [0603 Resistor]  (hidden comment: Resistor 10k 0603)
R56  value 10k  [0603 Resistor]  (hidden comment: Resistor 10k 0603)
R59  10R  [THT 3W resistor]
R60  10R  [THT 3W resistor]
R61  value 10k  [0603 Resistor]  (hidden comment: Resistor 10k 0603)
R62  value 10k  [0603 Resistor]  (hidden comment: Resistor 10k 0603)

### Nets
BAT1: R53.2(CW)
BAT2: R54.2(CW)
BAT3: R59.2(CW)
BAT4: R60.2(CW)
DIS1: Q1.1(G) R55.1(CCW)
DIS2: Q2.1(G) R56.1(CCW)
DIS3: Q3.1(G) R61.1(CCW)
DIS4: Q4.1(G) R62.1(CCW)
GND: Q1.2(S) Q2.2(S) Q3.2(S) Q4.2(S) R55.2(CW) R56.2(CW) R61.2(CW) R62.2(CW)  [project net -BAT1]
NetQ1_3: Q1.3(D) R53.1(CCW)
NetQ2_3: Q2.3(D) R54.1(CCW)
NetQ3_3: Q3.3(D) R59.1(CCW)
NetQ4_3: Q4.3(D) R60.1(CCW)

### Library data of the parts
Q1-Q4 = BSS138: N-Channel 50 V 220mA (Ta) 350mW (Ta) Surface Mount SOT-23-3; MF: onsemi; SnapEDA_Link: https://www.snapeda.com/parts/BSS138/Onsemi/view-part/?ref=snap; Package: SOT-23-3 Motorola; Value: *; MP: BSS138; Check_prices: https://www.snapeda.com/parts/BSS138/Onsemi/view-part/?ref=eda
R53 R54 R59 R60 = 15R 3W THT
R55 R56 R61 R62 = CMP-009-00225-1: 10k 0603; Source: 0603.SchLib; Component Type: Standard; Design Item ID: Resistor 10k 0603; Pins: 2

## Nets that join several sheets
5V: MCU (16 pins), DCDC (5 pins)
-BAT1: Chargers (64 pins), Balancers (32 pins), MCU (30 pins), USB (24 pins), Dischargers (8 pins)
BAT1: Chargers (9 pins), Balancers (J7.3 R63.2 R64.2), MCU (R17.1), Dischargers (R53.2)
BAT2: Chargers (9 pins), Balancers (J9.3 R48.2 R50.2), MCU (R19.1), Dischargers (R54.2)
BAT3: Chargers (9 pins), Balancers (J8.3 R44.2 R45.2), MCU (R20.1), Dischargers (R59.2)
BAT4: Chargers (9 pins), Balancers (J10.3 R49.2 R67.2), MCU (R18.1), Dischargers (R60.2)
DIS1: MCU (U4.38), Dischargers (Q1.1 R55.1)
DIS2: MCU (U4.37), Dischargers (Q2.1 R56.1)
DIS3: MCU (U4.36), Dischargers (Q3.1 R61.1)
DIS4: MCU (U4.35), Dischargers (Q4.1 R62.1)
SCL: MCU (J3.1 U4.6), USB (U13.7)
SDA: MCU (J3.2 U4.7), USB (U13.8)
USB_ALRT: MCU (U4.25), USB (U13.19)
USB_ATTACH: MCU (U4.26), USB (U13.11)
VBUS: Chargers (16 pins), DCDC (5 pins), USB (C80.2 D23.C Q6.5 R58.2)